# Altium schematic sheet EMI Filter.SchDoc
size A
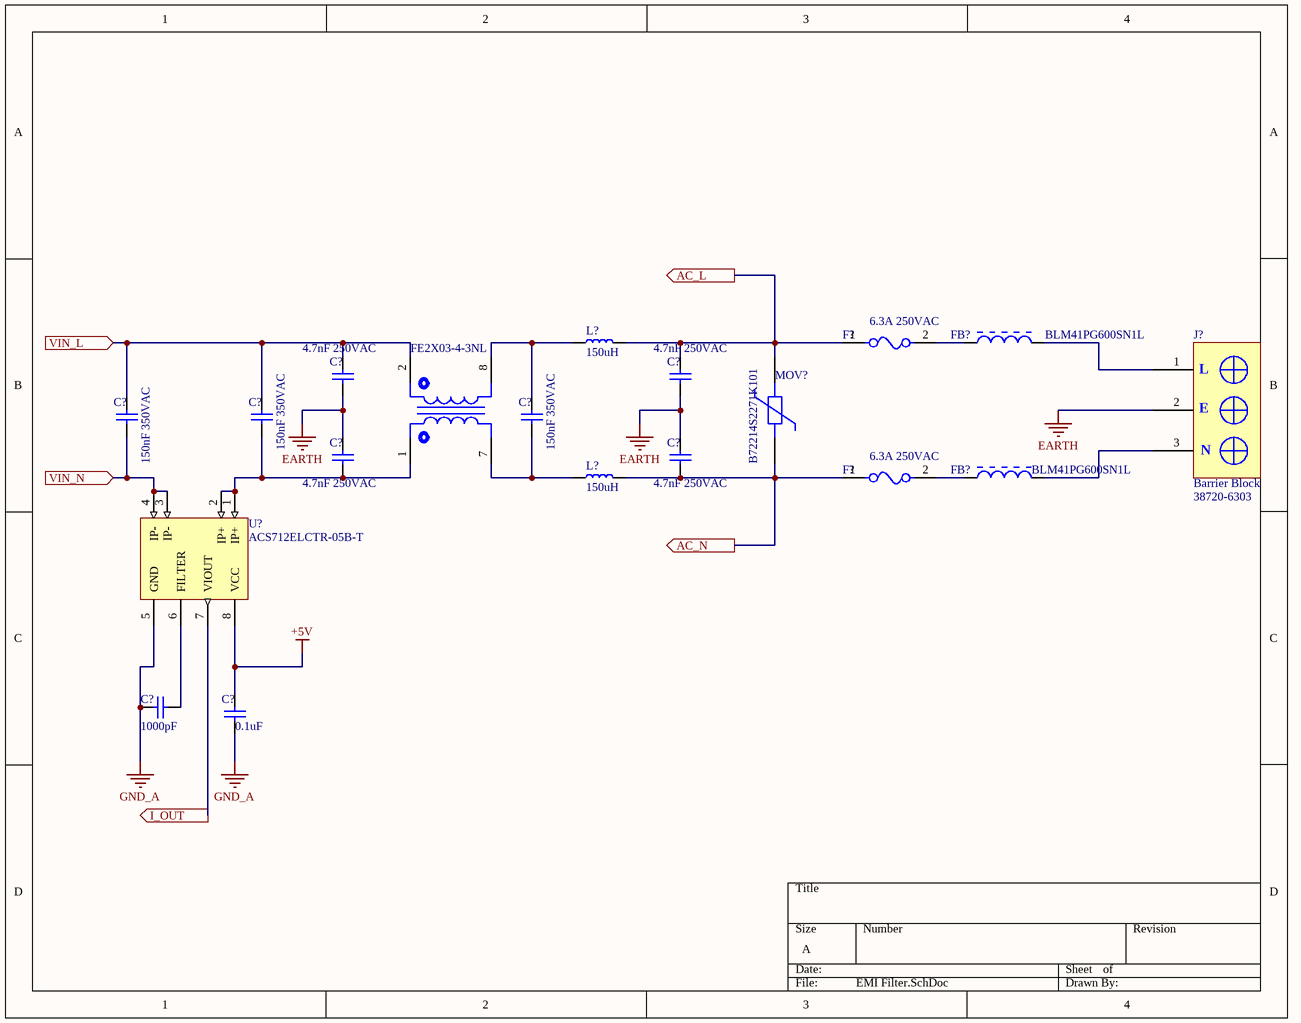
[diagram p0: EMI Filter.SchDoc]

## Parts
(Parts that share a designator on the sheet are numbered #1, #2 ... from top to bottom, then left to right.)
?  FE2X03-4-3NL  [FE2X03-4-3NL]
C?#1  4.7nF 250VAC  [1206 CAPACITOR]
C?#2  4.7nF 250VAC  [1206 CAPACITOR]
C?#3  150nF 350VAC  [1206 CAPACITOR]
C?#4  150nF 350VAC  [1206 CAPACITOR]
C?#5  150nF 350VAC  [1206 CAPACITOR]
C?#6  4.7nF 250VAC  [1206 CAPACITOR]
C?#7  4.7nF 250VAC  [1206 CAPACITOR]
C?#8  1000pF  [1206 CAPACITOR]
C?#9  0.1uF  [1206 CAPACITOR]
F?#1  6.3A 250VAC  [230VAC RADIAL FUSE]
F?#2  6.3A 250VAC  [230VAC RADIAL FUSE]
FB?#1  BLM41PG600SN1L  [Ferrite Bead]
FB?#2  BLM41PG600SN1L  [Ferrite Bead]
J?  Barrier Block  Supplier Part Number 1: 38720-6303  [Blcok Terminal]
L?#1  150uH  [Inductor MSS7341-224ML]
L?#2  150uH  [Inductor MSS7341-224ML]
MOV?  B72214S2271K101  [DISC 14MM]
U?  ACS712ELCTR-05B-T  [8 Lead SOIC]

## Ports
AC_L (out), AC_N (out), I_OUT (out), VIN_L (in), VIN_N (in)

## Nets
+5V: C?#9.2 U?.8(VCC)
EARTH: C?#1.1 C?#2.1 C?#6.2 C?#7.2 J?.2
GND_A: C?#8.1 C?#9.1 U?.5(GND)
AC_L: C?#2.2 F?#1.1 L?#1.2 MOV?.1 ; port AC_L
AC_N: C?#7.1 F?#2.1 L?#2.2 MOV?.2 ; port AC_N
I_OUT: U?.7(VIOUT) ; port I_OUT
VIN_L: ?.2 C?#1.2 C?#3.2 C?#4.2 ; port VIN_L
VIN_N: C?#3.1 U?.3(IP-) U?.4(IP-) ; port VIN_N
Net?_1: ?.1 C?#4.1 C?#6.1 U?.1(IP+) U?.2(IP+)
Net?_7: ?.7 C?#5.1 L?#2.1
Net?_8: ?.8 C?#5.2 L?#1.1
NetC?#8_2: C?#8.2 U?.6(FILTER)
NetF?#1_2: F?#1.2 FB?#1.1
NetF?#2_2: F?#2.2 FB?#2.1
NetFB?#1_2: FB?#1.2 J?.1
NetFB?#2_2: FB?#2.2 J?.3

## Notes on the sheet
- (in symbol Barrier Block) L; E; N

## Library data of the parts
? = FE2X03-4-3NL: CHOKE COM MODE 2PHASE NOISE SUP; Manufacturer: Pulse; Number of Lines: 2; Lead/Base Style: PC Pin; Inductance: 3.3mH; DC Resistance (DCR): 90mR; Current: 2.5A; Self Resonant Frequency: 700kHz; Supplier 1: Mouser; Manufacturer Part Number: FE2X03-4-3NL; RoHS: Yes; Category: Common Mode Chokes; Stock 1: 485; Pricing 1: 1=3.62000, 10=3.22000, 100=2.17000, 250=2.10000, 500=1.93000, 1000=1.81000 (USD); Mount: Through Hole; Case/Package: DIP; Number of Pins: 4; Min Operating Temperature: 0°C; Max Operating Temperature: 60°C; Packaging: Rail/Tube; Package Quantity: 20; Max DC Current: 2.5A; Termination: Radial; Length: 22.9mm; Height: 0.606inch; Width: 22.9mm; Lead Pitch: 4mm; Depth: 22.9mm; Radiation Hardening: No; ComponentLink1URL: https://datasheet.ciiva.com/3293/+p538-3293276.pdf?src-supplier=Avnet; ComponentLink1Description: https://datasheet.ciiva.com/3293/+p538-3293276.pdf?src-supplier=Avnet; ComponentLink2URL: https://datasheet.ciiva.com/6214/+p538-6214495.pdf?src-supplier=Digi-Key; ComponentLink2Description: https://datasheet.ciiva.com/6214/+p538-6214495.pdf?src-supplier=Digi-Key; Supplier Part Number 1: 673-FE2X03-4-3NL
C?#1-C?#9 = Capacitor Non-Polorized: Value: 10uF; Case-EIA: 1206; Tolerance: -20% to +80%; Rated Voltage: 25 V; Case-Metric: 3216; Max Thickness: 1.9 mm; Technology: SMT
F?#1 F?#2 = FUSE 6.3A: FUSE BOARD MNT 500MA 250VAC RAD; Manufacturer: Schurter; Manufacturer Part Number: 0034.6011; Max Fuse Ac Voltage: 250V; Fuse I2T: 0.09A2Sec; Fuse Current: 0.5A; Standoff Height: 0.5mm; Fuse Voltage Drop: 350mV; Fuse Blow Speed: Fast; Category: Fuse; RoHS: TRUE; Device Class L3: unset; Lead Free: Yes; Height: 8.5mm; ComponentLink2URL: https://us.schurter.com/en/datasheet/typ_MSF_250.pdf; Voltage Rating: 250V; ComponentLink2Description: Datasheet; Ambient Temperature Range Low: -40°C; Digikey Description: FUSE BOARD MNT 500MA 250VAC RAD; Automotive: No; Octopart: https://octopart.com/0034.6011-schurter-8310; Package: 0034.6011; Device Class L2: Fuses; Ambient Temperature Range High: +85°C; Device Class L1: Circuit Protection
FB?#1 FB?#2 = Ferrite Bead: Chip Ferrite Bead for Power Lines, 60 Ohm, 6000 mA, -55 to 125 degC, 4.5 x 1.6 x 1.8 mm SMD, Tape and Reel; Manufacturer: Murata; Rated Current: 6000 mA; Impedance (at 100 MHz): 60 Ohm Typ.; DC Resistance: 0.009 Ohm Max.; Packing: Tape and Reel; Mounting Technology: Surface Mount; ComponentLink3URL: http://www.murata.com/products/catalog/pdf/c31e.pdf; ComponentLink3Description: Package Specification; ComponentLink1URL: http://www.murata.com/; PackageDescription: 2-Pin Chip, Body 4.5 x 1.6 mm; ComponentLink1Description: Manufacturer URL; ComponentLink2URL: http://www.murata.com/products/catalog/pdf/c31e.pdf; PartNumber: BLM41PG600SN1L; ComponentLink2Description: Datasheet; PackageReference: BLM41-2; Operating Temperature Range: -55 to 125 degC; DatasheetVersion: 08/2013
J? = Barrier Block: Conn Barrier Strip 3 POS 9.52mm Solder ST Thru-Hole 15A/Contact; Manufacturer: Molex; Manufacturer Part Number: 0387206303; Number of Circuits: 3; Current Rating: 15A; Voltage Rating: 300V; Pitch: 0.375inch; Wire Gauge (Max): 22AWG; Wire Gauge (Min): 14AWG; Supplier 1: Arrow; RoHS: Yes; Category: Terminal Blocks; Stock 1: 404; Pricing 1: 1=2.52170, 10=1.97000, 25=1.82640, 50=1.64670, 100=1.59580, 250=1.40110, 500=1.27850, 1000=1.15620, 5000=1.01550 (USD); Mount: Through Hole; Contact Plating: Zinc; Contact Material: Steel; Color: Black; Housing Material: Thermoplastic; Housing Color: Black; Insulation Material: Thermoplastic; Min Operating Temperature: -40°C; Max Operating Temperature: 130°C; Termination: Solder; Number of Contacts: 3; Number of Rows: 1; Packaging: Tray; Orientation: Straight; Number of Wire Entries: 3; Max Supply Voltage: 300V; Length: 30.7mm; Depth: 15.7mm; Radiation Hardening: No; Flammability Rating: UL94 V-0; ComponentLink1URL: https://datasheet.ciiva.com/15170/getdatasheetpartid-255060-15170068.pdf?src-supplier=Verical; ComponentLink1Description: https://datasheet.ciiva.com/15170/getdatasheetpartid-255060-15170068.pdf?src-supplier=Verical; ComponentLink2URL: https://datasheet.ciiva.com/3141/0387206303-terminal-blocks-3141193.pdf?src-supplier=Avnet; ComponentLink2Description: https://datasheet.ciiva.com/3141/0387206303-terminal-blocks-3141193.pdf?src-supplier=Avnet; ComponentLink3URL: https://datasheet.ciiva.com/18547/387206306-sd-18547693.pdf?src-supplier=Digi-Key; ComponentLink3Description: https://datasheet.ciiva.com/18547/387206306-sd-18547693.pdf?src-supplier=Digi-Key
L?#1 L?#2 = Inductor
MOV? = B72214S2271K101: SUPPRESSOR; Product Range:AdvanceD Series; Voltage Rating VDC:350V; Peak Surge Current @ 8/20 S:6kA; Varistor Case Style:Disc 14mm; Clamping Voltage Vc Max:710V; Peak Energy (10/1000uS):110J; Voltage Rating VAC:275V; MSL:- ;RoHS Compliant: Yes; Manufacturer: TDK EPCOS; Number of Circuits: 1; Max Voltage Rating (AC): 275V; Max Voltage Rating (DC): 350V; Energy: 110J; Max Surge Current: 6kA; Min Varistor Voltage: 387V; Varistor Voltage: 430V; Max Varistor Voltage: 473V; Supplier 1: Mouser; Manufacturer Part Number: B72214S2271K101; RoHS: Yes; Category: Varistors; Stock 1: 3472; Pricing 1: 1=0.58000, 10=0.43600, 100=0.28900, 1000=0.21800, 2500=0.19000, 10000=0.17300, 25000=0.16800, 50000=0.16400, 100000=0.16000 (USD); Mount: Through Hole; Case/Package: Radial; Package Quantity: 500; Packaging: Bulk; ComponentLink1URL: https://datasheet.ciiva.com/3024/siov-leaded-advanced-3024826.pdf?src-supplier=Avnet; ComponentLink1Description: https://datasheet.ciiva.com/3024/siov-leaded-advanced-3024826.pdf?src-supplier=Avnet; Supplier Part Number 1: 871-B72214S2271K101
U? = ACS712ELCTR-05B-T: Linear Current Sensor, 4.5 to 5.5 V, 10 mA Output Current, -40 to 85 degC, 8-Pin SOIC (LC), RoHS, Tape and Reel; Manufacturer: Allegro Microsystems; SVHC: NoSVHC(19-Dec-2012); Supply Voltage Min: 4.5V; Accuracy: 1.5%; No. of Pins: 8; Supply Voltage Max: 5.5V; Bandwidth: 50kHz; Quiescent Current: 8mA; Supply Voltage Range: 4.5Vto5.5V; Polarisation: Unipolar; Package Description: 8-Pin Small Outline Integrated Circuit, Body 4.9 x 3.9 mm, Pitch 1.27 mm; Operating Temperature Min: -40degC; Datasheet URL: http://www.allegromicro.com/~/media/Files/Datasheets/ACS712-Datasheet.ashx?la=en; Operating Temperature Range: -40degCto+85degC; MSL: MSL2-1year; Sensor Case Style: SOIC; Termination Type: SMD; Manufacturer URL: http://www.allegromicro.com/; Sensor / Transducer Type: Current; Package Reference: LC-8; Operating Temperature Max: 85degC; Datasheet Version: Rev. 15, 11/2012